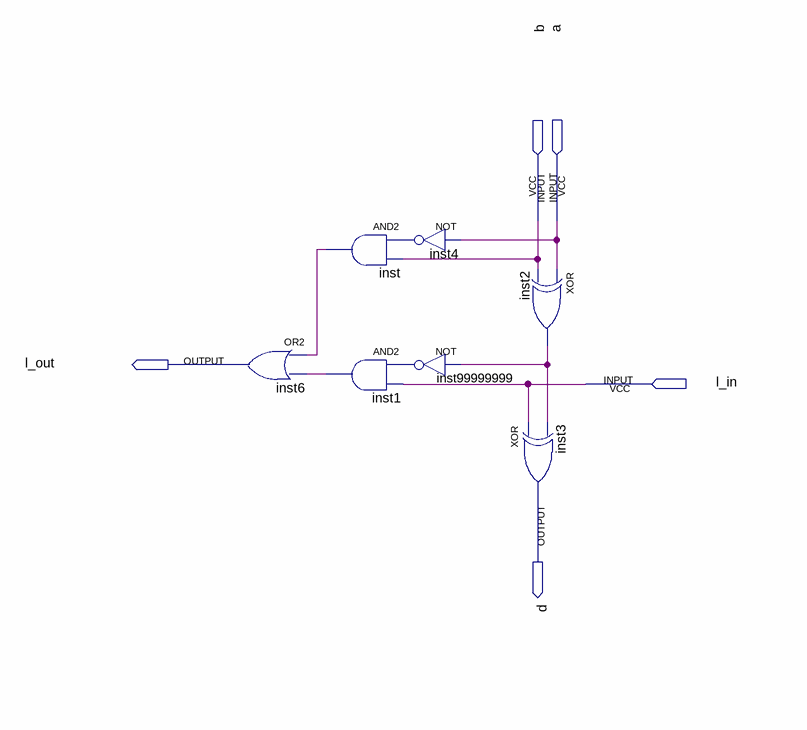
[diagram p0: schematic sheet]
// Quartus schematic full_subtractor.bdf as structural Verilog: 7 symbols, 5 pins
module full_subtractor (
  input  b,
  input  a,
  input  l_in,
  output l_out,
  output d
);

  wire inst1_out, inst2_out, inst4_out, inst99999999_out, inst_out;

  or inst6 (l_out, inst_out, inst1_out);
  and inst (inst_out, inst4_out, b);
  and inst1 (inst1_out, inst99999999_out, l_in);
  not inst4 (inst4_out, a);
  not inst99999999 (inst99999999_out, inst2_out);
  xor inst2 (inst2_out, a, b);
  xor inst3 (d, l_in, inst2_out);
endmodule
